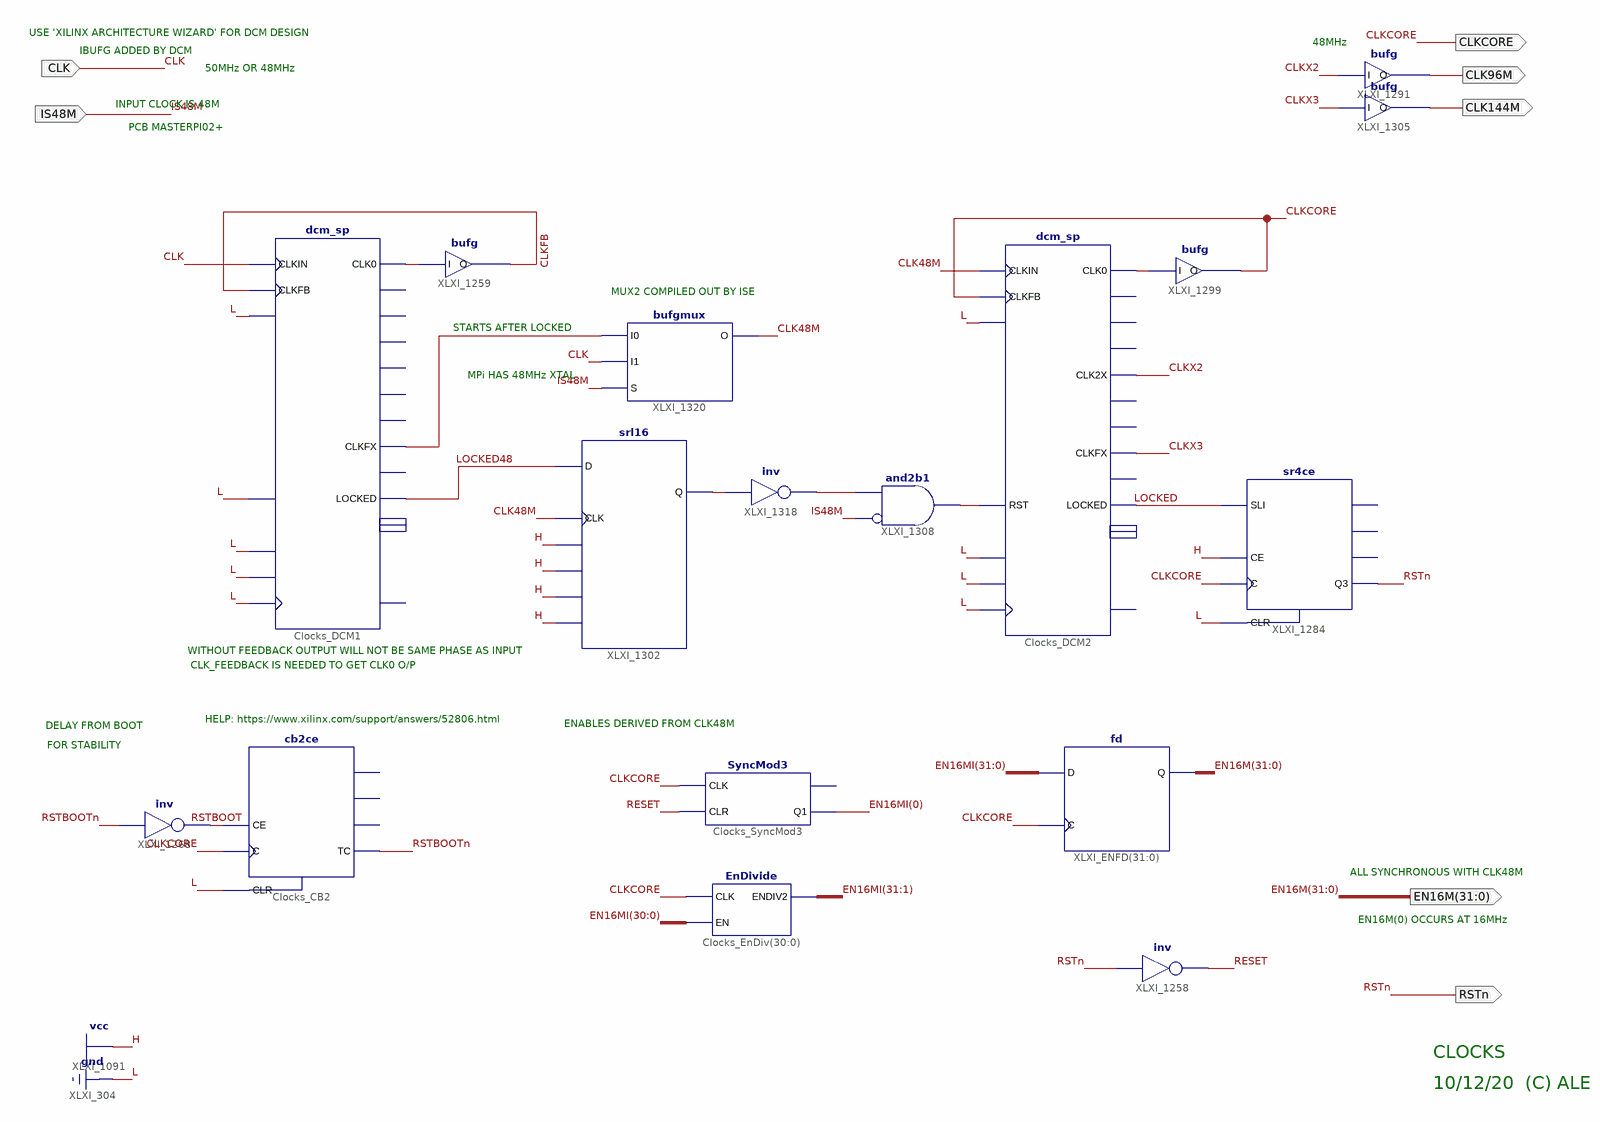
[diagram p0: schematic sheet 1]
// Xilinx ISE schematic Clocks_Pi.sch (spartan6) as structural Verilog: 17 symbols, 7 ports
module Clocks_Pi (
  input  CLK,
  input  IS48M,
  output RSTn,
  output [31:0] EN16M,
  output CLKCORE,
  output CLK96M,
  output CLK144M
);

  wire CLK48M, CLKFB, CLKX2, CLKX3, LOCKED, LOCKED48, RESET, RSTBOOT, RSTBOOTn, XLXN_2946, XLXN_2961,
       XLXN_2992, XLXN_3043, XLXN_3102, XLXN_3103;
  wire [31:0] EN16MI;

  not XLXI_1268 (RSTBOOT, RSTBOOTn);
  cb2ce Clocks_CB2 (.C(CLKCORE), .CE(RSTBOOT), .CLR(1'b0), .TC(RSTBOOTn));  // open: CEO, Q0, Q1
  SyncMod3 Clocks_SyncMod3 (.CLK(CLKCORE), .CLR(RESET), .Q1(EN16MI[0]));  // open: Q0
  EnDivide Clocks_EnDiv[30:0] (.CLK(CLKCORE), .EN(EN16MI[30:0]), .ENDIV2(EN16MI[31:1]));
  fd XLXI_ENFD[31:0] (.C(CLKCORE), .D(EN16MI), .Q(EN16M));
  not XLXI_1258 (RESET, RSTn);
  bufg XLXI_1291 (.I(CLKX2), .O(CLK96M));
  bufg XLXI_1305 (.I(CLKX3), .O(CLK144M));
  dcm_sp #(.CLKFX_MULTIPLY(24), .DFS_FREQUENCY_MODE("LOW"), .DLL_FREQUENCY_MODE("LOW"), .CLK_FEEDBACK("1X"), .CLKIN_PERIOD(20), .CLKFX_DIVIDE(25)) Clocks_DCM1 (
    .CLKFB(CLKFB), .CLKIN(CLK), .DSSEN(1'b0), .PSCLK(1'b0), .PSEN(1'b0), .PSINCDEC(1'b0), .RST(1'b0),
    .CLK0(XLXN_2946), .CLKFX(XLXN_3043), .LOCKED(LOCKED48));  // open: CLK180, CLK270, CLK2X, CLK2X180, CLK90, CLKDV, CLKFX180, PSDONE, STATUS
  bufg XLXI_1259 (.I(XLXN_2946), .O(CLKFB));
  dcm_sp #(.CLKFX_MULTIPLY(3), .DFS_FREQUENCY_MODE("LOW"), .DLL_FREQUENCY_MODE("LOW"), .CLK_FEEDBACK("1X"), .CLKIN_PERIOD(20.8), .CLKFX_DIVIDE(1)) Clocks_DCM2 (
    .CLKFB(CLKCORE), .CLKIN(CLK48M), .DSSEN(1'b0), .PSCLK(1'b0), .PSEN(1'b0), .PSINCDEC(1'b0),
    .RST(XLXN_2992), .CLK0(XLXN_2961), .CLK2X(CLKX2), .CLKFX(CLKX3), .LOCKED(LOCKED));  // open: CLK180, CLK270, CLK2X180, CLK90, CLKDV, CLKFX180, PSDONE, STATUS
  bufg XLXI_1299 (.I(XLXN_2961), .O(CLKCORE));
  sr4ce XLXI_1284 (.C(CLKCORE), .CE(1'b1), .CLR(1'b0), .SLI(LOCKED), .Q3(RSTn));  // open: Q0, Q1, Q2
  srl16 XLXI_1302 (.A0(1'b1), .A1(1'b1), .A2(1'b1), .A3(1'b1), .CLK(CLK48M), .D(LOCKED48), .Q(XLXN_3103));
  not XLXI_1318 (XLXN_3102, XLXN_3103);
  and XLXI_1308 (XLXN_2992, ~IS48M, XLXN_3102);  // and2b1
  bufgmux XLXI_1320 (.I0(XLXN_3043), .I1(CLK), .S(IS48M), .O(CLK48M));

  // Notes on the sheet:
  //   USE 'XILINX ARCHITECTURE WIZARD' FOR DCM DESIGN
  //   48MHz
  //   IBUFG ADDED BY DCM
  //   50MHz OR 48MHz
  //   INPUT CLOCK IS 48M
  //   PCB MASTERPI02+
  //   MUX2 COMPILED OUT BY ISE
  //   STARTS AFTER LOCKED
  //   MPi HAS 48MHz XTAL
  //   WITHOUT FEEDBACK OUTPUT WILL NOT BE SAME PHASE AS INPUT
  //   CLK_FEEDBACK IS NEEDED TO GET CLK0 O/P
  //   HELP: https://www.xilinx.com/support/answers/52806.html
  //   ENABLES DERIVED FROM CLK48M
  //   DELAY FROM BOOT
  //   FOR STABILITY
  //   ALL SYNCHRONOUS WITH CLK48M
  //   EN16M(0) OCCURS AT 16MHz
  //   CLOCKS
  //   10/12/20  (C) ALE
endmodule
